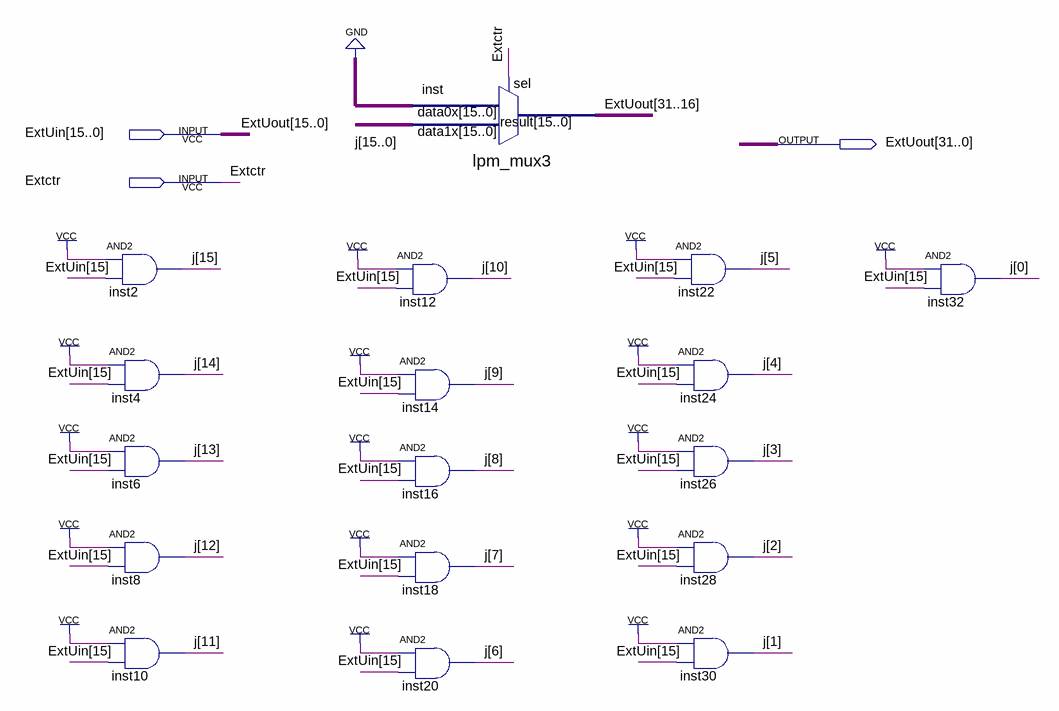
[diagram p0: schematic sheet]
// Quartus schematic ExtU.bdf as structural Verilog: 17 symbols, 3 pins
module ExtU (
  input  [15:0] ExtUin,
  input  Extctr,
  output [31:0] ExtUout
);

  wire [15:0] j;

  and inst2 (j[15], 1'b1, ExtUin[15]);
  and inst4 (j[14], 1'b1, ExtUin[15]);
  and inst6 (j[13], 1'b1, ExtUin[15]);
  and inst8 (j[12], 1'b1, ExtUin[15]);
  and inst10 (j[11], 1'b1, ExtUin[15]);
  lpm_mux3 inst (.data1x(j), .data0x({16{1'b0}}), .sel(Extctr), .result(ExtUout[31:16]));
  and inst12 (j[10], 1'b1, ExtUin[15]);
  and inst14 (j[9], 1'b1, ExtUin[15]);
  and inst16 (j[8], 1'b1, ExtUin[15]);
  and inst18 (j[7], 1'b1, ExtUin[15]);
  and inst20 (j[6], 1'b1, ExtUin[15]);
  and inst22 (j[5], 1'b1, ExtUin[15]);
  and inst24 (j[4], 1'b1, ExtUin[15]);
  and inst26 (j[3], 1'b1, ExtUin[15]);
  and inst28 (j[2], 1'b1, ExtUin[15]);
  and inst30 (j[1], 1'b1, ExtUin[15]);
  and inst32 (j[0], 1'b1, ExtUin[15]);

  assign ExtUout[15:0] = ExtUin;
endmodule
